# EAGLE design jtag-adapter (EAGLE 9.3.0)
CNAME: PepeTech; CREVISION: 1; DESIGNER: Joao Silva
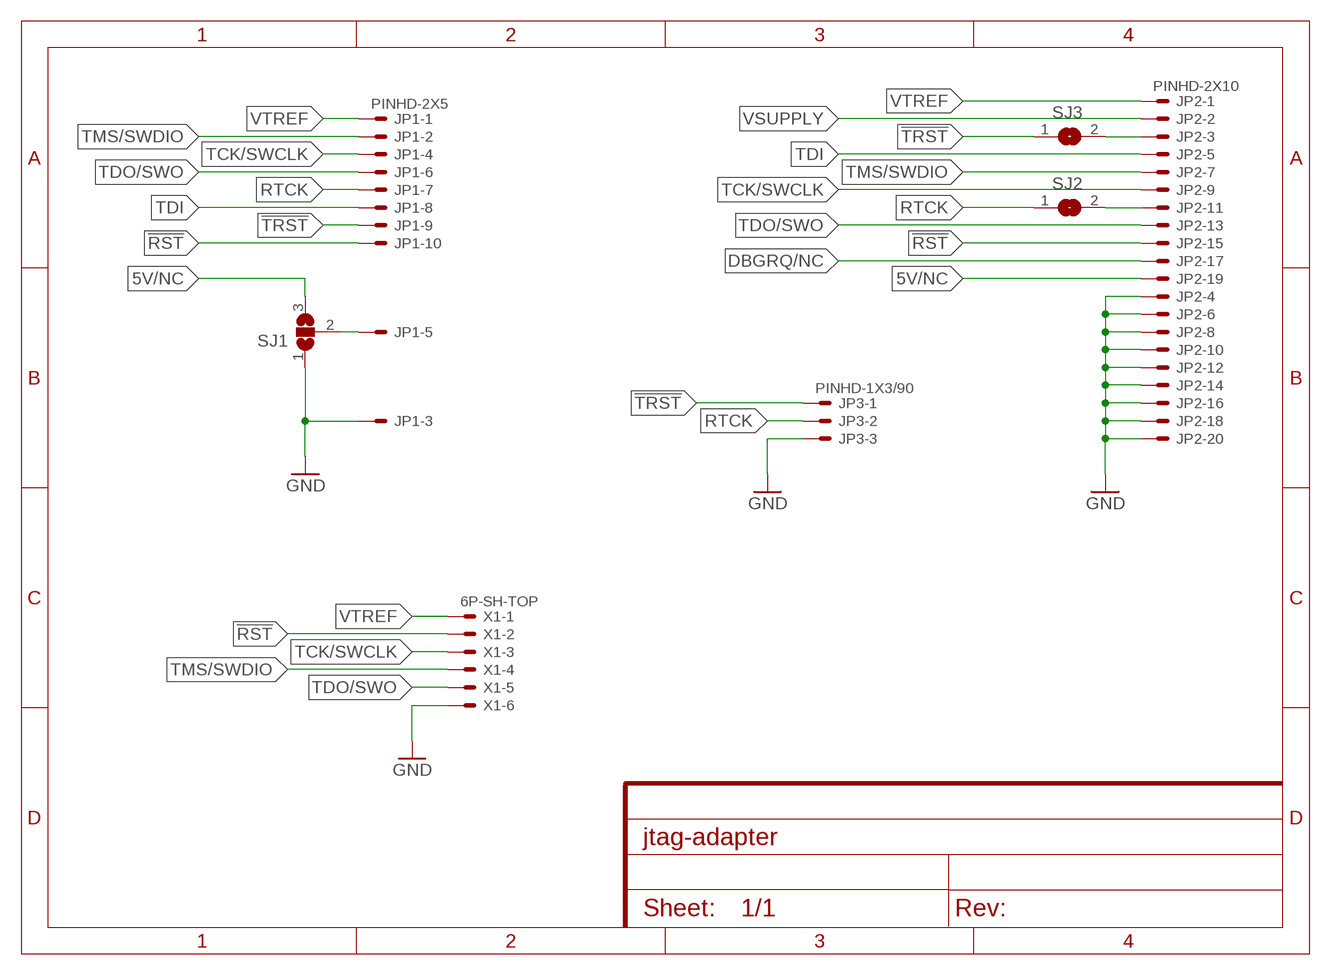
[diagram p0: schematic, sheet 1]

## Parts
JP1  PINHD-2X5  [2X05]
JP2  PINHD-2X10  [2X10]
JP3  PINHD-1X3/90  [1X03/90]
SJ1  SJ2S  [SJ2_S]
SJ2  SJS  [SJ_S]
SJ3  SJS  [SJ_S]
X1  6P-SH-TOP  [SH-06-TOP]

## Nets
5V/NC: JP2.19 SJ1.3
!RST: JP1.10 JP2.15 X1.2
!TRST: JP1.9 JP3.1 SJ3.1
DBGRQ/NC: JP2.17
GND: JP1.3 JP2.4 JP2.6 JP2.8 JP2.10 JP2.12 JP2.14 JP2.16 JP2.18 JP2.20 JP3.3 SJ1.1 X1.6
N$1: JP2.11 SJ2.2
N$2: JP1.5 SJ1.2
N$3: JP2.3 SJ3.2
RTCK: JP1.7 JP3.2 SJ2.1
TCK/SWCLK: JP1.4 JP2.9 X1.3
TDI: JP1.8 JP2.5
TDO/SWO: JP1.6 JP2.13 X1.5
TMS/SWDIO: JP1.2 JP2.7 X1.4
VSUPPLY: JP2.2
VTREF: JP1.1 JP2.1 X1.1

## Library data of the parts
JP1 = Pin Header:PINHD-2X5: PIN HEADER
JP2 = Pin Header:PINHD-2X10: PIN HEADER
JP3 = Pin Header:PINHD-1X3: PIN HEADER
SJ1 = Solder Jumper:SJ2
SJ2 SJ3 = Solder Jumper:SJ
X1 = JST:6P: Disconnectable Crimp style connector, 1.0mm pitch 6 contacts

## Board
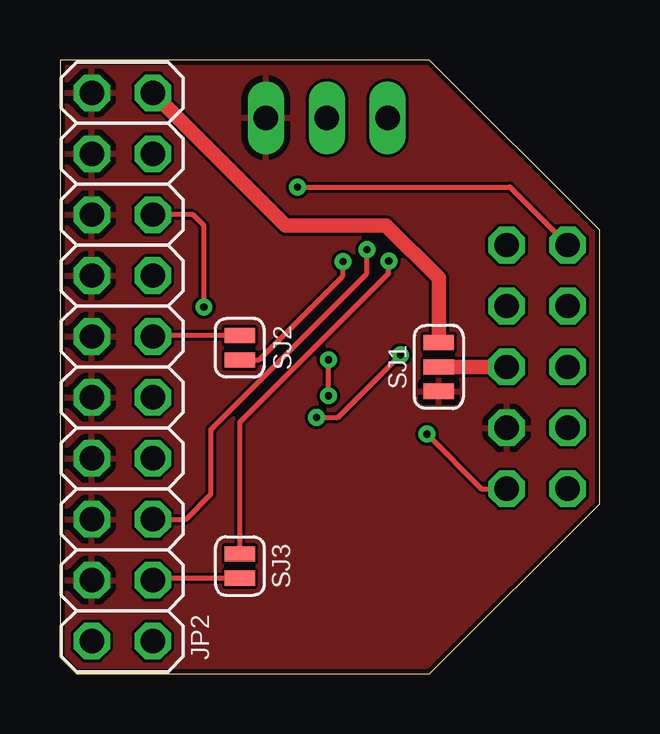
[diagram p1: board, top side]
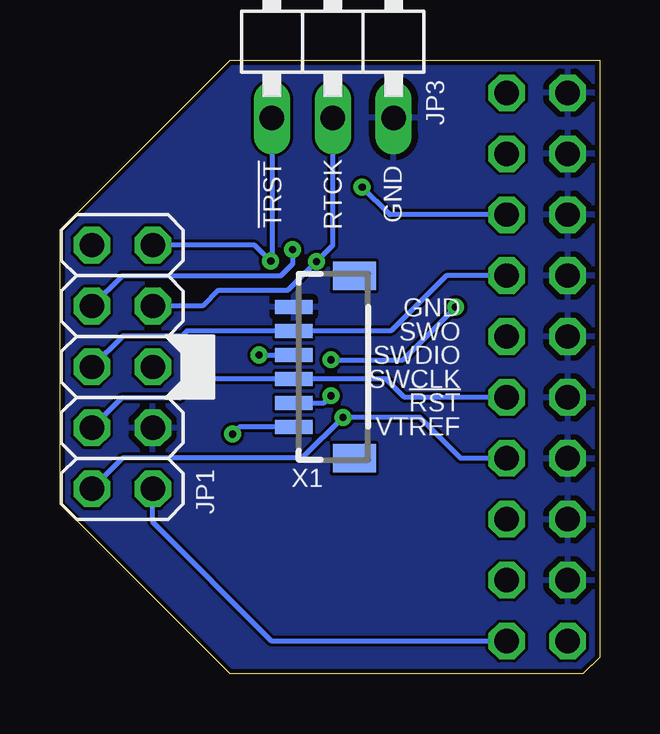
[diagram p2: board, bottom side, seen from below]

Size 22.5 x 25.6 mm. Coordinates in mm from the lower left corner, seen from the top.
Outline: 0,25.6 0,0.7 0.7,0 15.4,0 22.5,7.1 22.5,18.5 15.4,25.6 0,25.6
Copper layers (1*16): Top 0.035mm / dielectric 1.6mm / Bottom 0.035mm
Design rules "jlcpcb": minimum track width 5mil, minimum drill 0.3mm, track to track 5mil, track to pad 5mil, pad to pad 5mil, via to via 5mil, smd to smd 5mil, copper to edge 0.2mm, drill to drill 5mil, minimum pad ring 10mil, minimum via ring 8mil, stop-mask expansion 4mil, vias tented up to drill 10mm, thermal gap 10mil

### Footprints (pad centres in the part's own frame; a part is rotated, then mirrored left to right if it is on the bottom)
2X05 = drill 1.016 octagon: 1 -5.08,-1.27; 2 -5.08,1.27; 3 -2.54,-1.27; 4 -2.54,1.27; 5 0,-1.27; 6 0,1.27; 7 2.54,-1.27; 8 2.54,1.27; 9 5.08,-1.27; 10 5.08,1.27
2X10 = drill 1.016 octagon: 1 -11.43,-1.27; 2 -11.43,1.27; 3 -8.89,-1.27; 4 -8.89,1.27; 5 -6.35,-1.27; 6 -6.35,1.27; 7 -3.81,-1.27; 8 -3.81,1.27; 9 -1.27,-1.27; 10 -1.27,1.27; 11 1.27,-1.27; 12 1.27,1.27; 13 3.81,-1.27; 14 3.81,1.27; 15 6.35,-1.27; 16 6.35,1.27; 17 8.89,-1.27; 18 8.89,1.27; 19 11.43,-1.27; 20 11.43,1.27
1X03/90 = drill 1.016 long: 1 -2.54,-3.81; 2 0,-3.81; 3 2.54,-3.81
SJ2_S = smd 0.635 x 1.27: 1 -1.016,0; 2 0,0; 3 1.016,0
SJ_S = smd 0.635 x 1.27: 1 -0.508,0; 2 0.508,0
SH-06-TOP = smd 0.6 x 1.55: 1 2.5,-1.625; 2 1.5,-1.625; 3 0.5,-1.625; 4 -0.5,-1.625; 5 -1.5,-1.625; 6 -2.5,-1.625 | smd 1.2 x 1.8: FIT@1 3.8,0.9; FIT@2 -3.8,0.9

### Placement (x,y rotation side)
JP1  19.9,12.8 90 bottom
JP2  2.6,12.8 90 top
JP3  11.12,27 0 bottom
SJ1  15.8,12.8 90 top
SJ2  7.5,13.6 90 top
SJ3  7.5,4.5 270 top
X1  11.12,12.8 270 bottom

### Tracks (layer width: path | path; a pad name or v marks a point on that pad's centre or on a via)
5V/NC
  Top 0.61: JP2.19 9.4,18.7 13.6,18.7 15.8,16.5 SJ1.3
!RST  (via drill 0.3)
  Top 0.2: v9.9,20.3 18.75,20.3 JP1.10 | v11.2,11.6 v11.2,13.1 | v6,15.3 6,18.7 5.55,19.15 JP2.15
  Bottom 0.2: JP2.15 8.75,19.15 v9.9,20.3 | X1.2 11.5,11.3 v11.2,11.6 | v11.2,13.1 8.2,13.1 v6,15.3
!TRST  (via drill 0.3)
  Top 0.2: v13.71,17.21 v13.7,17.2 13.7,16.7 7.5,10.5 SJ3.1
  Bottom 0.2: JP1.9 14.38,17.88 v13.71,17.21 13.66,17.26 JP3.1
GND
  pour Top: -3.9,28.9 29.4,28.9 29.4,-3.1 -3.9,-3.1
  pour Bottom: -5.8,30.9 31.5,30.9 31.5,-4.6 -5.8,-4.6
N$1
  Top 0.2: SJ2.2 3.91,14.11 JP2.11
N$2
  Top 0.61: SJ1.2 JP1.5
N$3
  Top 0.2: SJ3.2 3.95,3.99 JP2.3
RTCK  (via drill 0.3)
  Top 0.2: SJ2.1 8.29,13.09 11.8,16.6 v11.8,17.2
  Bottom 0.2: JP3.2 11.12,17.88 v11.8,17.2 13,16 15.9,16 16.56,15.34 JP1.7
TCK/SWCLK
  Bottom 0.2: JP2.9 8.13,11.53 8.9,12.3 X1.3 16.7,12.3 17.5,11.5 19.93,11.5 JP1.4
TDI  (via drill 0.3)
  Top 0.2: JP2.5 5.25,6.45 6.3,7.5 6.3,10.2 12.8,16.7 v12.8,17.7
  Bottom 0.2: v12.8,17.7 12.8,17.1 13.3,16.6 19.91,16.6 JP1.8
TDO/SWO
  Bottom 0.2: JP2.13 6.39,16.61 8.7,14.3 X1.5 17.2,14.3 17.4,14.1 19.87,14.1 JP1.6
TMS/SWDIO  (via drill 0.3)
  Top 0.2: v10.7,10.7 11.6,10.7 v14.2,13.3
  Bottom 0.2: JP2.7 5.79,8.99 7.5,10.7 v10.7,10.7 12.4,9 19.89,9 JP1.2 | v14.2,13.3 X1.4
VTREF  (via drill 0.3)
  Top 0.2: v15.3,10 17.58,7.72 JP1.1
  Bottom 0.2: JP2.1 13.67,1.37 18.63,6.33 JP1.1 | X1.1 15,10.3 v15.3,10

### Text on the board
bPlace: !TRST! / RTCK / GND | GND / SWO / SWDIO / SWCLK / !RST! / VTREF